# EAGLE design Controller - ESP32 Wroom - Rev. 0.9 (EAGLE 9.6.2)
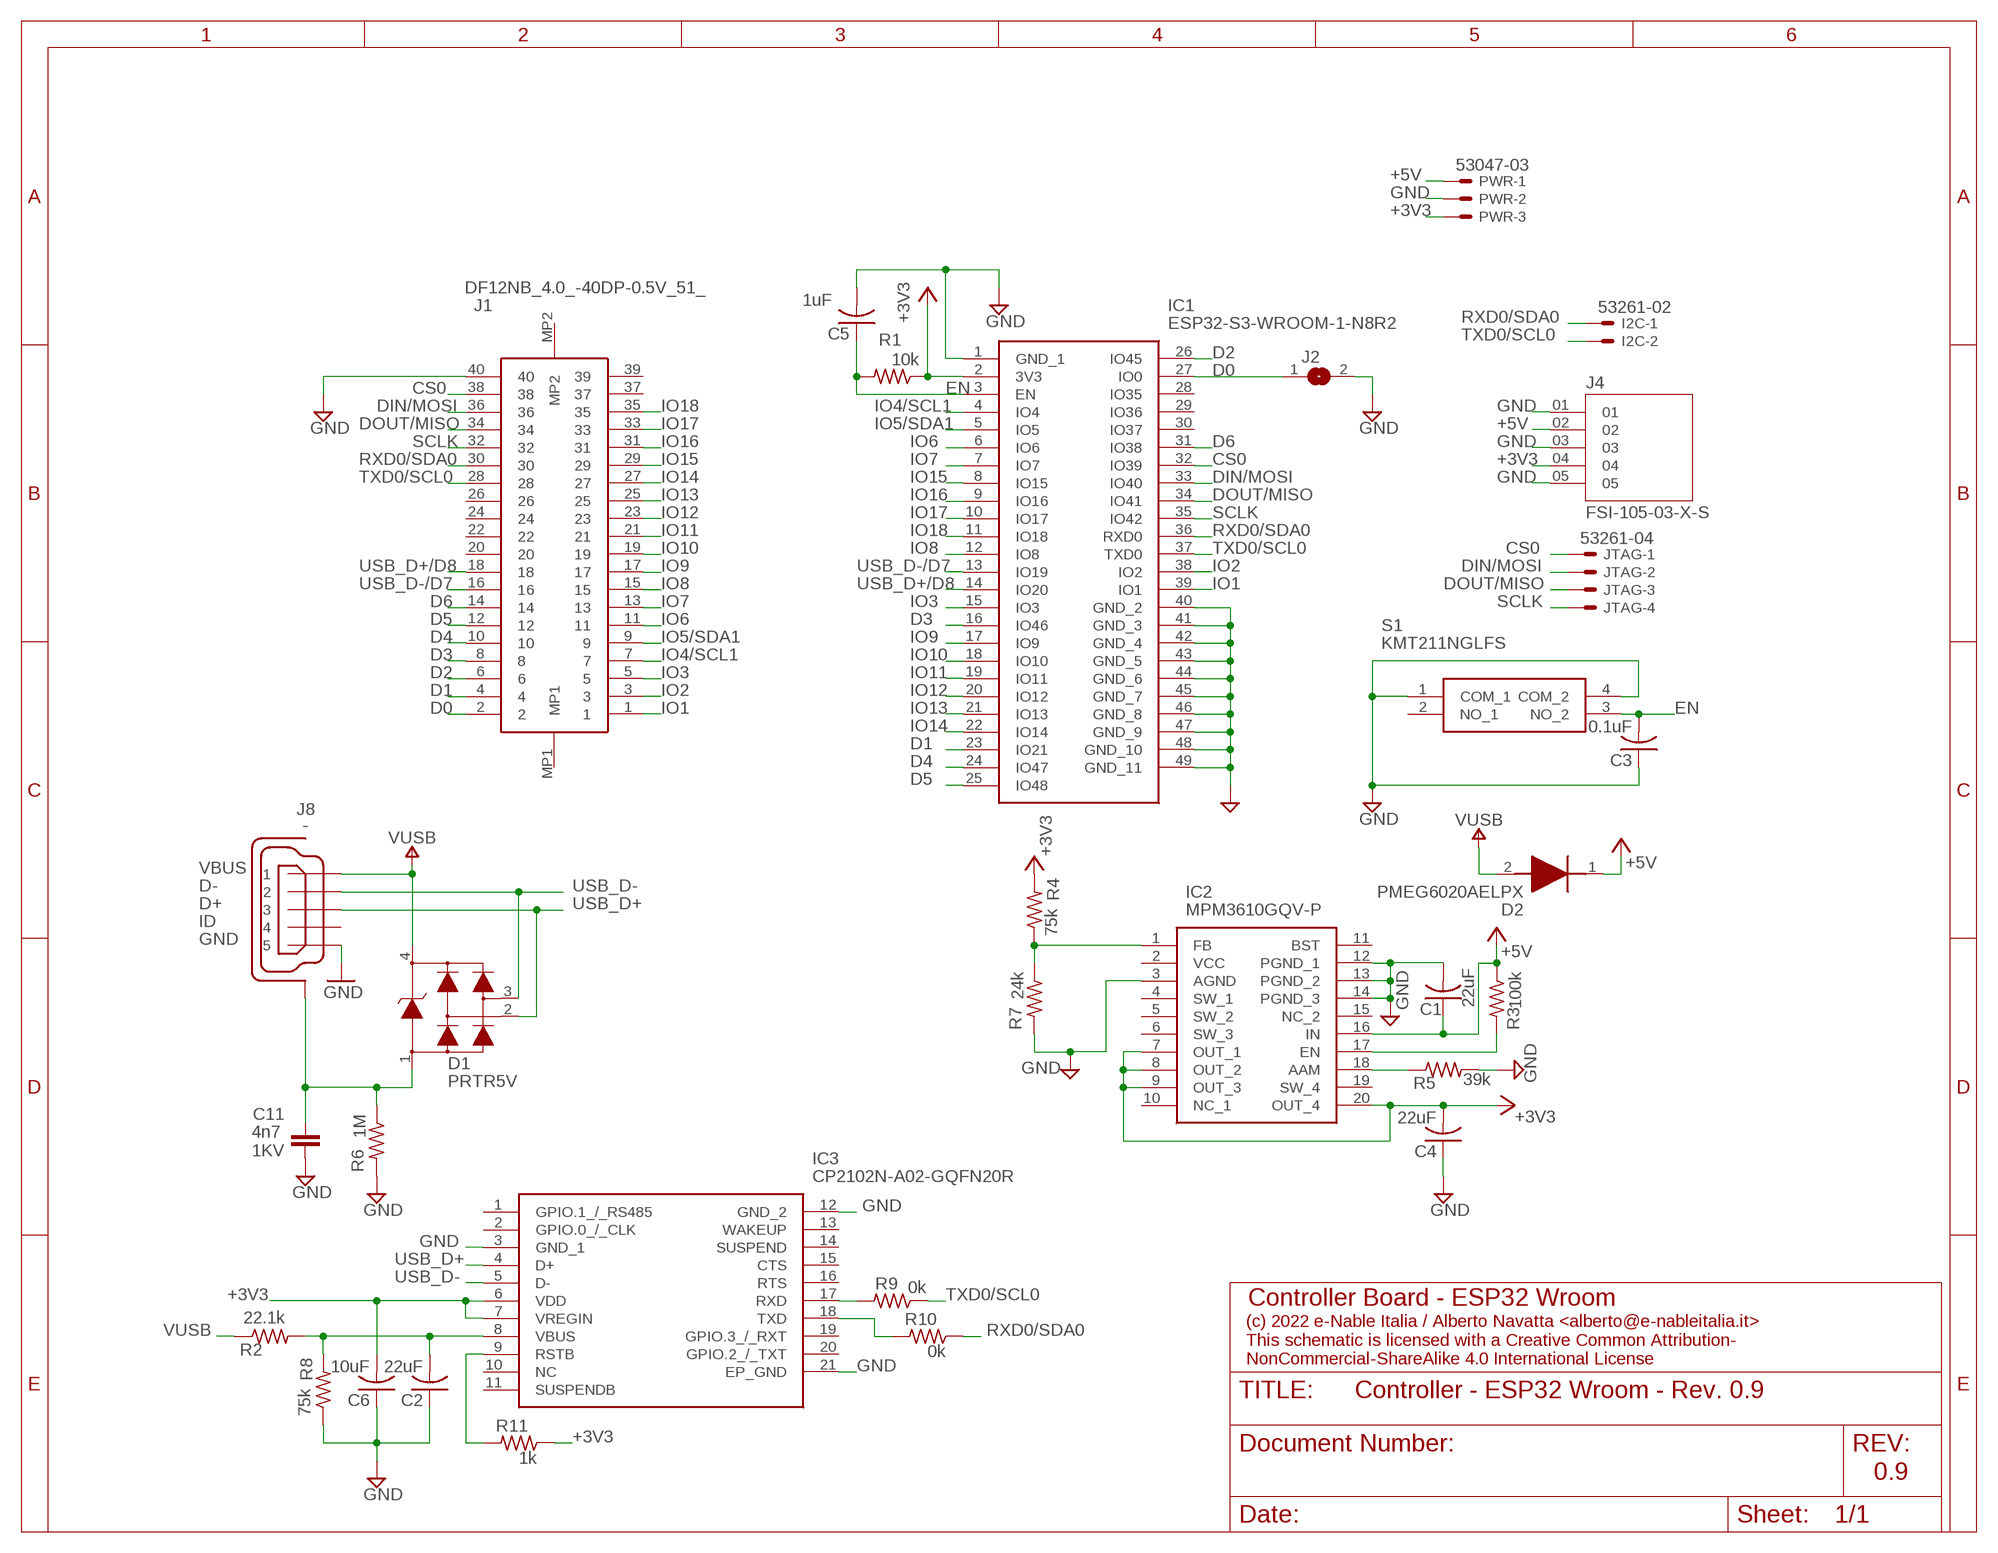
[diagram p0: schematic, sheet 1]

## Parts
C1  22uF  C-USC0603  [C0603]
C2  22uF  C-USC0402  [C0402]
C3  0.1uF  C-USC0402  [C0402]
C4  22uF  C-USC0603  [C0603]
C5  1uF  C-USC0402  [C0402]
C6  10uF  C-USC0402  [C0402]
C11  4n7  C4.7NF-0805  [0805-R2013X50N]
D1  PRTR5V  PRTR5V0U2X,215  [SOT190P230X110-4N]
D2  PMEG6020AELPX  [SODFL4725X110N]
I2C  53261-02  [53261-02]
IC1  ESP32-S3-WROOM-1-N8R2  [ESP32S3WROOM1N8R2]
IC2  MPM3610GQV-P  [MPM3610GQVP]
IC3  CP2102N-A02-GQFN20R  [CP2102NA02GQFN20]
J1  DF12NB_4.0_-40DP-0.5V_51_  [DF12NB4040DP05V51]
J2  SJ  [SJ]
J4  FSI-105-03-X-S  [SAMTEC_FSI-105-03-X-S]
J8  -  USB-MICRO  [ZX62-AB-5PA]
JTAG  53261-04  [53261-04]
PWR  53047-03  [53047-03]
R1  10k  R-US_R0402  [R0402]
R2  22.1k  R-US_R0402  [R0402]
R3  100k  R-US_R0402  [R0402]
R4  75k  R-US_R0402  [R0402]
R5  39k  R-US_R0402  [R0402]
R6  1M  R-US_R0402  [R0402]
R7  24k  R-US_R0402  [R0402]
R8  75k  R-US_R0402  [R0402]
R9  0k  R-US_R0402  [R0402]
R10  0k  R-US_R0402  [R0402]
R11  1k  R-US_R0402  [R0402]
S1  KMT211NGLFS  [KMT211NGLFS]

## Nets
+3V3 [Power]: C4.2 C6.2 IC1.2(3V3) IC2.7(OUT_1) IC2.8(OUT_2) IC2.9(OUT_3) IC2.20(OUT_4) IC3.6(VDD) IC3.7(VREGIN) J4.04 PWR.3 R1.1 R4.2 R11.1
+5V [Power]: C1.1 D2.1(K) IC2.16(IN) J4.02 PWR.1 R3.1
CS0: IC1.32(IO39) J1.38 JTAG.1
D0: IC1.27(IO0) J1.2 J2.1
D1: IC1.23(IO21) J1.4
D2: IC1.26(IO45) J1.6
D3: IC1.16(IO46) J1.8
D4: IC1.24(IO47) J1.10
D5: IC1.25(IO48) J1.12
D6: IC1.31(IO38) J1.14
DIN/MOSI: IC1.33(IO40) J1.36 JTAG.2
DOUT/MISO: IC1.34(IO41) J1.34 JTAG.3
EN: C3.2 C5.1 IC1.3(EN) R1.2 S1.3(NO_2)
GND [GND]: C1.2 C2.1 C3.1 C4.1 C5.2 C6.1 C11.2 IC1.1(GND_1) IC1.40(GND_2) IC1.41(GND_3) IC1.42(GND_4) IC1.43(GND_5) IC1.44(GND_6) IC1.45(GND_7) IC1.46(GND_8) IC1.47(GND_9) IC1.48(GND_10) IC1.49(GND_11) IC2.3(AGND) IC2.12(PGND_1) IC2.13(PGND_2) IC2.14(PGND_3) IC3.3(GND_1) IC3.12(GND_2) IC3.21(EP_GND) J1.40 J2.2 J4.01 J4.03 J4.05 J8.5 PWR.2 R5.2 R6.2 R7.2 R8.1 S1.1(COM_1) S1.4(COM_2)
IO1: IC1.39(IO1) J1.1
IO2: IC1.38(IO2) J1.3
IO3: IC1.15(IO3) J1.5
IO4/SCL1: IC1.4(IO4) J1.7
IO5/SDA1: IC1.5(IO5) J1.9
IO6: IC1.6(IO6) J1.11
IO7: IC1.7(IO7) J1.13
IO8: IC1.12(IO8) J1.15
IO9: IC1.17(IO9) J1.17
IO10: IC1.18(IO10) J1.19
IO11: IC1.19(IO11) J1.21
IO12: IC1.20(IO12) J1.23
IO13: IC1.21(IO13) J1.25
IO14: IC1.22(IO14) J1.27
IO15: IC1.8(IO15) J1.29
IO16: IC1.9(IO16) J1.31
IO17: IC1.10(IO17) J1.33
IO18: IC1.11(IO18) J1.35
N$1: IC2.18(AAM) R5.1
N$2: C2.2 IC3.8(VBUS) R2.2 R8.2
N$3: IC2.1(FB) R4.1 R7.1
N$4: IC2.17(EN) R3.2
N$5: IC3.17(RXD) R9.2
N$6: IC3.18(TXD) R10.2
N$7: C11.1 D1.1 J8.6(SH) J8.7(SH) J8.8(SH) J8.9(SH) J8.10(SH) J8.11(SH) R6.1
N$8: IC3.9(RSTB) R11.2
RXD0/SDA0: I2C.1 IC1.36(RXD0) J1.30 R10.1
SCLK: IC1.35(IO42) J1.32 JTAG.4
TXD0/SCL0: I2C.2 IC1.37(TXD0) J1.28 R9.1
USB_D+: D1.2 IC3.4(D+) J8.3
USB_D+/D8: IC1.14(IO20) J1.18
USB_D-: D1.3 IC3.5(D-) J8.2
USB_D-/D7: IC1.13(IO19) J1.16
VUSB [Power]: D1.4 D2.2(A) J8.1 R2.1
Unconnected: IC1.28(IO35) IC1.29(IO36) IC1.30(IO37) IC2.2(VCC) IC2.4(SW_1) IC2.5(SW_2) IC2.6(SW_3) IC2.10(NC_1) IC2.11(BST) IC2.15(NC_2) IC2.19(SW_4) IC3.1(GPIO.1_/_RS485) IC3.2(GPIO.0_/_CLK) IC3.10(NC) IC3.11(SUSPENDB) IC3.13(WAKEUP) IC3.14(SUSPEND) IC3.15(CTS) IC3.16(RTS) IC3.19(GPIO.3_/_RXT) IC3.20(GPIO.2_/_TXT) J1.20 J1.22 J1.24 J1.26 J1.37 J1.39 J1.MP1 J1.MP2 J8.4 S1.2(NO_1)

## Notes on the sheet
- Controller Board - ESP32 Wroom
- (c) 2022 e-Nable Italia / Alberto Navatta <alberto@e-nableitalia.it>
  This schematic is licensed with a Creative Common Attribution-
  NonCommercial-ShareAlike 4.0 International License
- 0.9

## Library data of the parts
C1-C6 = rcl:C-US: CAPACITOR, American symbol; SPICEPREFIX: C
C11 = Arduino-rcl:C: SMD Capacitor; CODE-ARDUINO: 0689; DATASHEET: http://www.kemet.com/Lists/ProductCatalog/Attachments/40/KEM_C1010_X7R_HV_SMD.pdf; DISTRIBUTOR-LINK: www.kemet.com/docfinder?Partnumber=C0805C472KDRACTU; DISTRIBUTOR-PN: 399-6738-1-ND; MANUFACTURER: Kemet; MANUFACTURER-PN: C0805C472KDRACTU; NOTE: -; VOLTAGE: 1KV
D1 = Arduino-diodes:PRTR5V0U2X,215: USB ESD protection; CODE-ARDUINO: 2209; DATASHEET: http://www.nxp.com/documents/data_sheet/PRTR5V0U2X.pdf; DISTRIBUTOR-LINK: http://www.digikey.com/product-detail/en/nxp-semiconductors/PRTR5V0U2X,215/568-4140-1-ND/1589981; DISTRIBUTOR-PN: 568-4140-1-ND; MANUFACTURER: NXP; MANUFACTURER-PN: PRTR5V0U2X,215
D2 = SamacSys_Parts:PMEG6020AELPX: NEXPERIA - PMEG6020AELPX - Schottky Rectifier, 60 V, 2 A, Single, SOD-128, 2 Pins, 670 mV Source: Datasheet <https://ms.componentsearchengine.com/Datasheets/2/PMEG6020AELPX.pdf>; DESCRIPTION: NEXPERIA - PMEG6020AELPX - Schottky Rectifier, 60 V, 2 A, Single, SOD-128, 2 Pins, 670 mV; HEIGHT: 1.1mm; MANUFACTURER_NAME: Nexperia; MANUFACTURER_PART_NUMBER: PMEG6020AELPX; MOUSER_PART_NUMBER: 771-PMEG6020AELPX; MOUSER_PRICE-STOCK: https://www.mouser.co.uk/ProductDetail/Nexperia/PMEG6020AELPX?qs=bel5lzaZNxQeOe%2FrOz5yeQ%3D%3D
I2C = con-molex:53?-02: CONNECTOR wire to board 1.25 mm (.049 inch) pitch header; MF: MOLEX; OC_FARNELL: 1125373; OC_NEWARK: unknown
IC1 = SamacSys_Parts:ESP32-S3-WROOM-1-N8R2: WiFi Modules - 802.11 (Engineering Samples Only) SMD Module, ESP32-S3R2, 2 MB PSRAM, 8 MB SPI Flash, PCB Antenna ,, Source: Datasheet; DESCRIPTION: WiFi Modules - 802.11 (Engineering Samples Only) SMD Module, ESP32-S3R2, 2 MB PSRAM, 8 MB SPI Flash, PCB Antenna ,,; HEIGHT: 3.25mm; MANUFACTURER_NAME: Espressif Systems; MANUFACTURER_PART_NUMBER: ESP32-S3-WROOM-1-N8R2; MOUSER_PART_NUMBER: 356-ESP32-S3WRM1N8R2; MOUSER_PRICE-STOCK: https://www.mouser.co.uk/ProductDetail/Espressif-Systems/ESP32-S3-WROOM-1-N8R2?qs=Wj%2FVkw3K%252BMCC1Ha9x85iJA%3D%3D
IC2 = SamacSys_Parts:MPM3610GQV-P: Switching Voltage Regulators 24V/1A DC/DC Mini- Module Reg w Inductr Source: Datasheet <https://componentsearchengine.com/Datasheets/1/MPM3610GQV-P.pdf>; DESCRIPTION: Switching Voltage Regulators 24V/1A DC/DC Mini- Module Reg w Inductr; HEIGHT: 1.65mm; MANUFACTURER_NAME: Monolithic Power Systems (MPS); MANUFACTURER_PART_NUMBER: MPM3610GQV-P; MOUSER_PART_NUMBER: 946-MPM3610GQV-P; MOUSER_PRICE-STOCK: https://www.mouser.co.uk/ProductDetail/Monolithic-Power-Systems-MPS/MPM3610GQV-P?qs=uA8e7uFv8Fj%2FtQLBFM6HcA%3D%3D
IC3 = SamacSys_Parts:CP2102N-A02-GQFN20R: Full Speed USB to UART Bridge USB 2.0 3.3V T/R Automotive 20-Pin QFN EP Source: Datasheet <https://www.silabs.com/documents/public/data-sheets/cp2102n-datasheet.pdf>; DESCRIPTION: Full Speed USB to UART Bridge USB 2.0 3.3V T/R Automotive 20-Pin QFN EP; HEIGHT: 0.8mm; MANUFACTURER_NAME: Silicon Labs; MANUFACTURER_PART_NUMBER: CP2102N-A02-GQFN20R; MOUSER_PART_NUMBER: 634-CP2102NA02QFN20R; MOUSER_PRICE-STOCK: https://www.mouser.co.uk/ProductDetail/Silicon-Labs/CP2102N-A02-GQFN20R?qs=u16ybLDytRbf2uwPkMBdUg%3D%3D
J1 = SamacSys_Parts:DF12NB_4.0_-40DP-0.5V_51_: Board to!! Board !! & Mezzanine Connectors CONN HDR 40POS SMD G Source: Datasheet <https://www.hirose.com/en/product/document?clcode=CL0537-0596-0-51&productname=DF12NB(4.0)-40DP-0.5V(51)&series=DF12N&documenttype=2DDrawing&lang=en&documentid=0001367371>; DESCRIPTION: Board to!! Board !! & Mezzanine Connectors CONN HDR 40POS SMD G; HEIGHT: 3.5mm; MANUFACTURER_NAME: Hirose; MANUFACTURER_PART_NUMBER: DF12NB(4.0)-40DP-0.5V(51); MOUSER_PART_NUMBER: 798-DF12NB4040DP0551; MOUSER_PRICE-STOCK: https://www.mouser.co.uk/ProductDetail/Hirose-Connector/DF12NB4.0-40DP-0.5V51?qs=DPoM0jnrROUKZpllIjGjYw%3D%3D
J2 = jumper:SJ: SMD solder JUMPER
J4 = FSI-105-03-X-S:FSI-105-03-X-S: 1mm SINGLE ELEMENT INTERFACE Check availability <https://pricing.snapeda.com/parts/FSI-105-03-G-S/Samtec/view-part?ref=eda>; AVAILABILITY: In Stock; DESCRIPTION: 5 Position Connector Stacking Compression Surface Mount Gold; MF: Samtec; MP: FSI-105-03-G-S; PACKAGE: None; PRICE: None; PURCHASE-URL: https://pricing.snapeda.com/search/part/FSI-105-03-G-S/?ref=eda
J8 = Arduino-connectors:USB-MICRO: USB - micro AB USB 2.0 Receptacle Connector 5 Position Surface Mount, Right Angle, Horizontal; CODE-ARDUINO: 2219; DATASHEET: https://www.hirose.com/product/en/download_file/key_name/ZX/category/Catalog/doc_file_id/31704/?file_category_id=4&item_id=13&is_series=1; DISTRIBUTOR-LINK: http://www.digikey.com/product-detail/en/hirose-electric-co-ltd/ZX62-AB-5PA(31)/H125279CT-ND/5994741; DISTRIBUTOR-PN: H125279CT-ND; MANUFACTURER: Hirose; MANUFACTURER-PN: ZX62-AB-5PA(31)
JTAG = con-molex:53?-04: CONNECTOR wire to board 1.25 mm (.049 inch) pitch header; MF: MOLEX; OC_FARNELL: 1125374; OC_NEWARK: unknown
PWR = con-molex:53?-03: CONNECTOR wire to board 1.25 mm (.049 inch) pitch header; MF: MOLEX; MPN: 530470310; OC_FARNELL: 9732853; OC_NEWARK: 14R5412
R1-R11 = rcl:R-US_: RESISTOR, American symbol; SPICEPREFIX: R
S1 = SamacSys_Parts:KMT211NGLFS: Tactile Switches SPST N.O. GULLWING FOR SMT Source: Datasheet <https://www.ckswitches.com/media/1455/kmt2.pdf>; DESCRIPTION: Tactile Switches SPST N.O. GULLWING FOR SMT; HEIGHT: 0.8mm; MANUFACTURER_NAME: C & K COMPONENTS; MANUFACTURER_PART_NUMBER: KMT211NGLFS; MOUSER_PART_NUMBER: 611-KMT211NGLFS; MOUSER_PRICE-STOCK: https://www.mouser.co.uk/ProductDetail/CK/KMT211NGLFS?qs=hvk6vzacGVhmRxqfjOQwQg%3D%3D

## Net classes
2 Power: width 0.203 mm

## Board
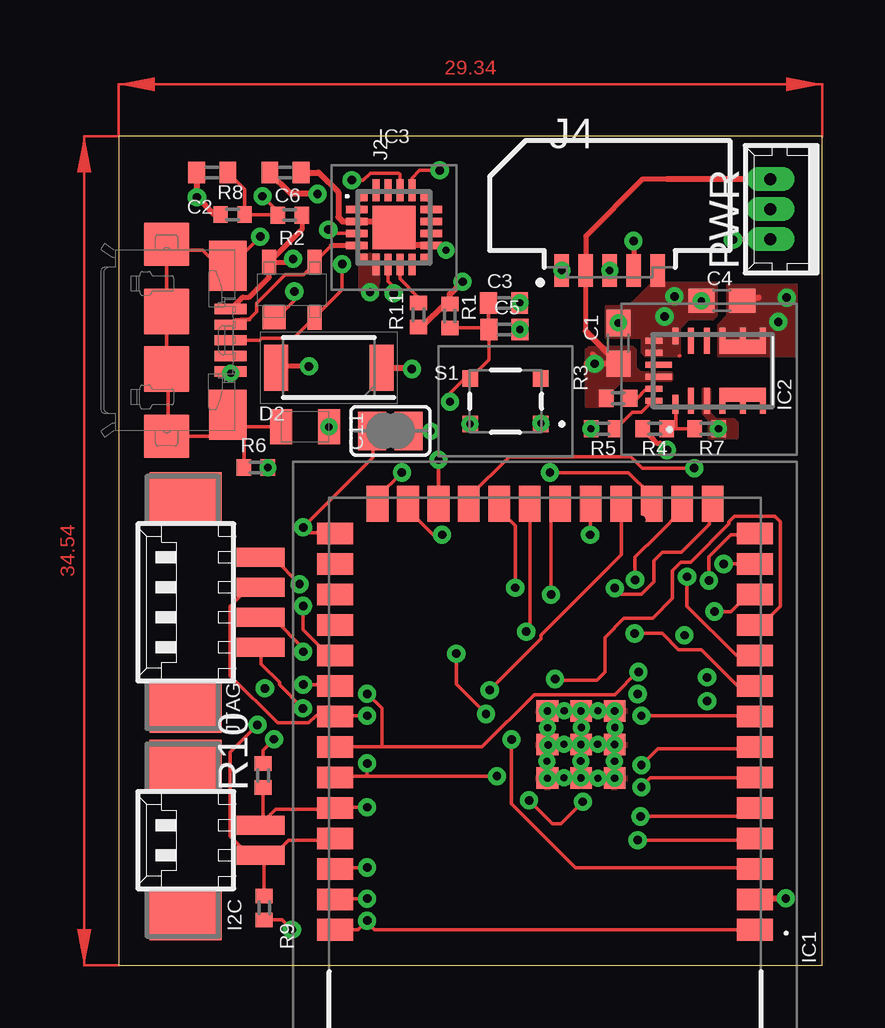
[diagram p1: board, top side]
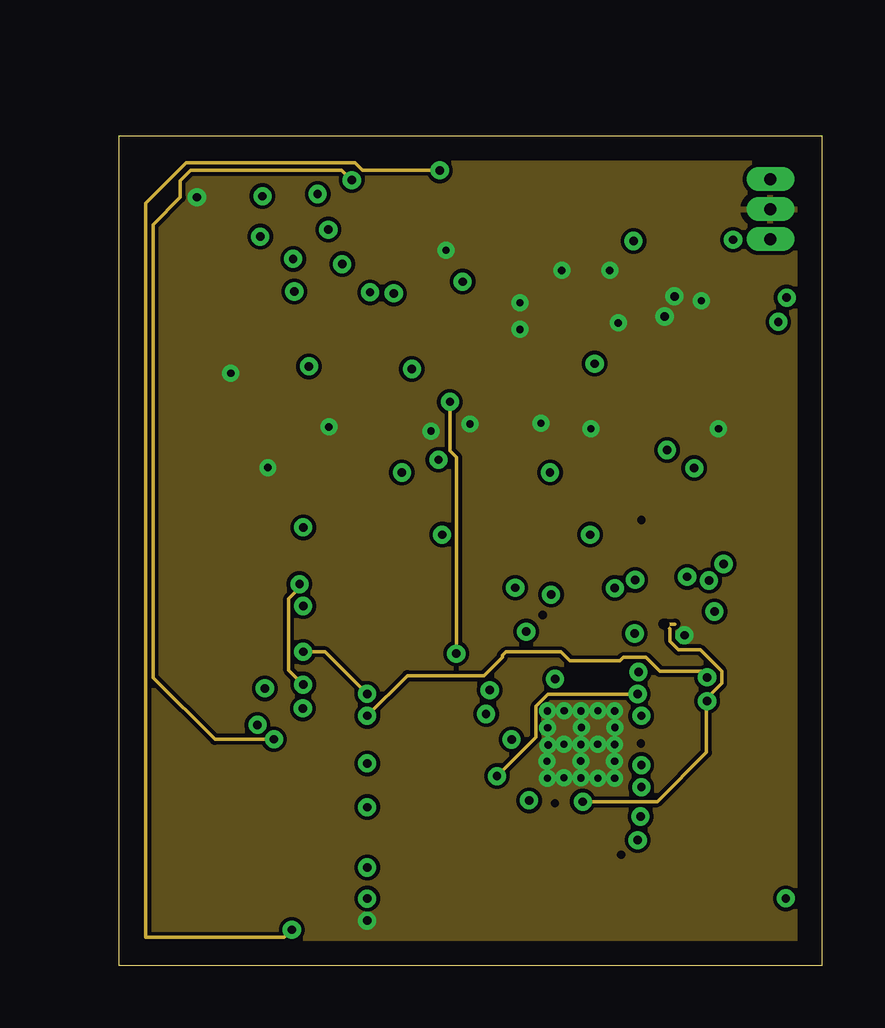
[diagram p2: board, inner layer Route2]
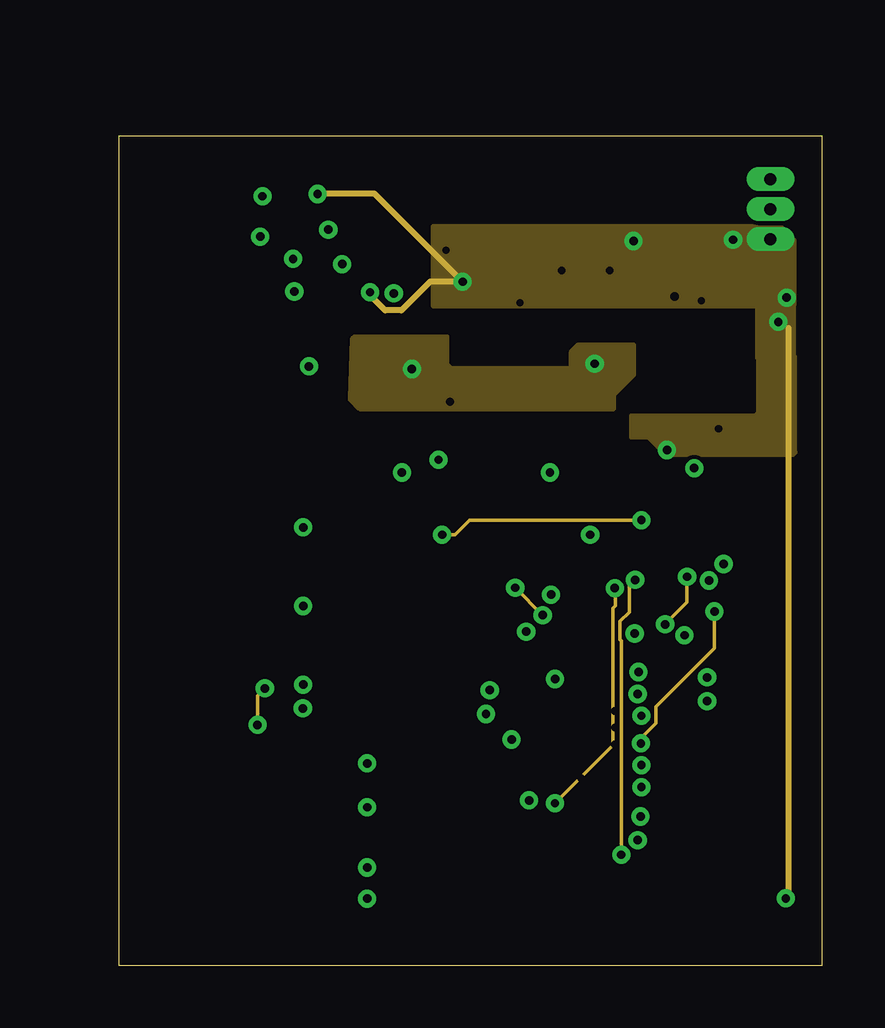
[diagram p3: board, inner layer Route15]
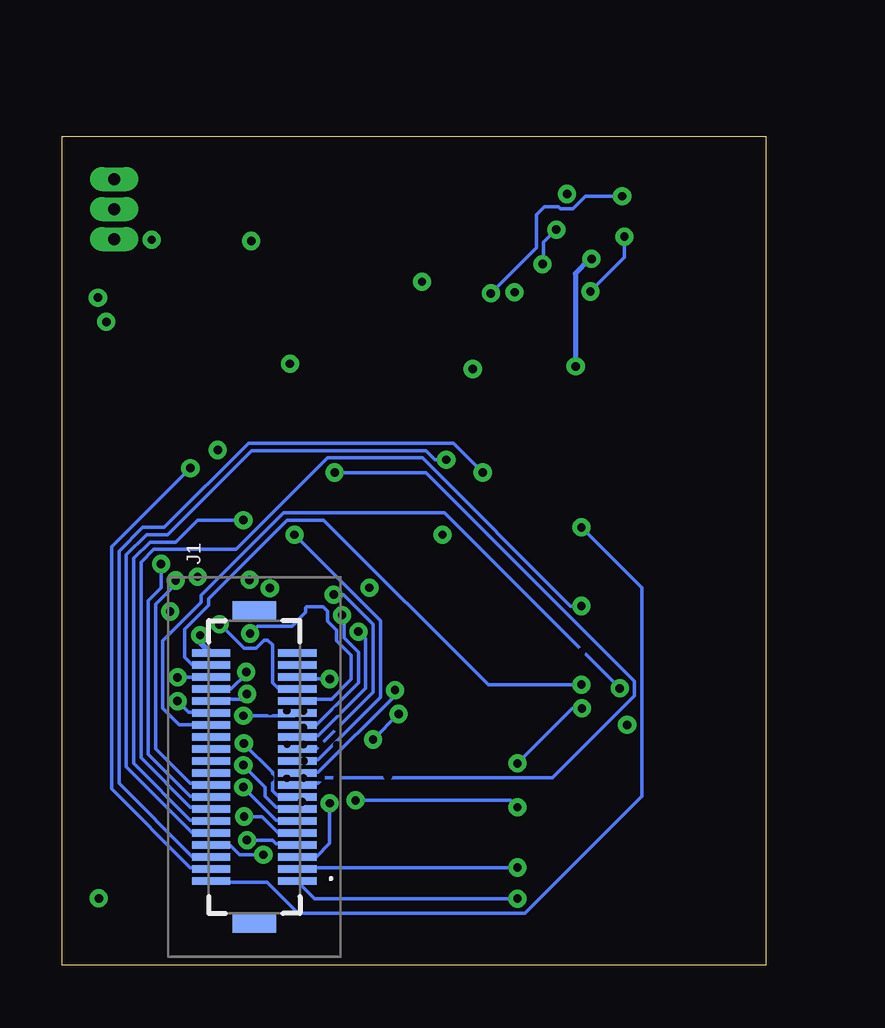
[diagram p4: board, bottom side, seen from below]

Size 29.34 x 34.54 mm. Coordinates in mm from the lower left corner, seen from the top.
Outline: 0,0 29.34,0 29.34,34.54 0,34.54 0,0
Copper layers ([2:1+(2*15)+16:15]): Top 0.035mm / dielectric 0.11mm / Route2 0.035mm / dielectric 1.6mm / Route15 0.035mm / dielectric 0.11mm / Bottom 0.035mm
Design rules "default *": minimum track width 6mil, minimum drill 0.35mm, track to track 6mil, track to pad 6mil, pad to pad 6mil, via to via 6mil, smd to smd 6mil, copper to edge 40mil, drill to drill 6mil, minimum pad ring 10mil, minimum via ring 8mil, stop-mask expansion 4mil, vias tented up to drill 0mil, thermal gap 10mil

### Footprints (pad centres in the part's own frame; a part is rotated, then mirrored left to right if it is on the bottom)
C0603 = smd 1.1 x 1: 1 -0.85,0; 2 0.85,0
C0402 = smd 0.7 x 0.9: 1 -0.65,0; 2 0.65,0
0805-R2013X50N = smd 0.95 x 1.45: 1 -1,0; 2 1,0
SOT190P230X110-4N = smd 1 x 1: 1 -1.15,0.75 | smd 1 x 0.6: 2 -1.15,-0.95; 3 1.15,-0.95; 4 1.15,0.95
SODFL4725X110N = smd 1 x 1.93: 1 -2.2,0; 2 2.2,0
53261-02 = smd 0.8 x 2: 1 0.625,-2.5; 2 -0.625,-2.5 | smd 2.1 x 3: S1 3.125,0.625; S2 -3.125,0.625
ESP32S3WROOM1N8R2 = smd 1.5 x 0.9: 1 -8.75,5.26; 2 -8.75,3.99; 3 -8.75,2.72; 4 -8.75,1.45; 5 -8.75,0.18; 6 -8.75,-1.09; 7 -8.75,-2.36; 8 -8.75,-3.63; 9 -8.75,-4.9; 10 -8.75,-6.17; 11 -8.75,-7.44; 12 -8.75,-8.71; 13 -8.75,-9.98; 14 -8.75,-11.25; 27 8.75,-11.25; 28 8.75,-9.98; 29 8.75,-8.71; 30 8.75,-7.44; 31 8.75,-6.17; 32 8.75,-4.9; 33 8.75,-3.63; 34 8.75,-2.36; 35 8.75,-1.09; 36 8.75,0.18; 37 8.75,1.45; 38 8.75,2.72; 39 8.75,3.99; 40 8.75,5.26 | smd 0.9 x 1.5: 15 -6.985,-12.5; 16 -5.715,-12.5; 17 -4.445,-12.5; 18 -3.175,-12.5; 19 -1.905,-12.5; 20 -0.635,-12.5; 21 0.635,-12.5; 22 1.905,-12.5; 23 3.175,-12.5; 24 4.445,-12.5; 25 5.715,-12.5; 26 6.985,-12.5 | smd 0.9 x 0.9: 41 -1.5,-2.46; 42 -1.5,-1.06; 43 -2.9,-1.06; 44 -2.9,-2.46; 45 -2.9,-3.86; 46 -1.5,-3.86; 47 -0.1,-3.86; 48 -0.1,-2.46; 49 -0.1,-1.06
MPM3610GQVP = smd 0.8 x 0.25: 1 -1.4,1.55 | smd 1.1 x 0.25: 2 -1.25,0.9; 3 -1.25,0.25; 10 1.25,0.25; 11 1.25,0.9 | smd 0.5 x 0.25: 4 -1.55,-0.4; 5 -1.55,-1.25; 6 -1.55,-2.1; 7 1.55,-2.1; 8 1.55,-1.25; 9 1.55,-0.4 | smd 0.7 x 0.25: 12 1.45,1.55 | smd 0.25 x 0.7: 13 1.25,2.45; 14 0.75,2.45; 17 -0.75,2.45; 18 -1.25,2.45 | smd 0.25 x 1.1: 15 0.25,2.25; 16 -0.25,2.25 | smd 0.6 x 1.95: 19 -1,-1.25; 20 1,-1.25
CP2102NA02GQFN20 = smd 0.3 x 0.3: 1 -1.25,1.25; 6 -1.25,-1.25; 11 1.25,-1.25; 16 1.25,1.25 | smd 0.9 x 0.3: 2 -1.55,0.75; 3 -1.55,0.25; 4 -1.55,-0.25; 5 -1.55,-0.75; 12 1.55,-0.75; 13 1.55,-0.25; 14 1.55,0.25; 15 1.55,0.75 | smd 0.3 x 0.9: 7 -0.75,-1.55; 8 -0.25,-1.55; 9 0.25,-1.55; 10 0.75,-1.55; 17 0.75,1.55; 18 0.25,1.55; 19 -0.25,1.55; 20 -0.75,1.55 | smd 1.8 x 1.8: 21 0,0
DF12NB4040DP05V51 = smd 0.3 x 1.6: 1 -4.75,-1.8; 2 -4.75,1.8; 3 -4.25,-1.8; 4 -4.25,1.8; 5 -3.75,-1.8; 6 -3.75,1.8; 7 -3.25,-1.8; 8 -3.25,1.8; 9 -2.75,-1.8; 10 -2.75,1.8; 11 -2.25,-1.8; 12 -2.25,1.8; 13 -1.75,-1.8; 14 -1.75,1.8; 15 -1.25,-1.8; 16 -1.25,1.8; 17 -0.75,-1.8; 18 -0.75,1.8; 19 -0.25,-1.8; 20 -0.25,1.8; 21 0.25,-1.8; 22 0.25,1.8; 23 0.75,-1.8; 24 0.75,1.8; 25 1.25,-1.8; 26 1.25,1.8; 27 1.75,-1.8; 28 1.75,1.8; 29 2.25,-1.8; 30 2.25,1.8; 31 2.75,-1.8; 32 2.75,1.8; 33 3.25,-1.8; 34 3.25,1.8; 35 3.75,-1.8; 36 3.75,1.8; 37 4.25,-1.8; 38 4.25,1.8; 39 4.75,-1.8; 40 4.75,1.8 | smd 0.8 x 1.8: MP1 -6.5,0; MP2 6.5,0
SJ = smd 1.168 x 1.6: 1 -0.762,0; 2 0.762,0
SAMTEC_FSI-105-03-X-S = smd 0.6 x 1.35: 01 -2,0; 02 -1,0; 03 0,0; 04 1,0; 05 2,0
ZX62-AB-5PA = smd 0.4 x 1.35: 1 -1.3,3.025; 2 -0.65,3.025; 3 0,3.025; 4 0.65,3.025; 5 1.3,3.025 | smd 2.1 x 1.6: 6 3.1,2.9; 11 -3.1,2.9 | smd 1.8 x 1.9: 7 4,0.35; 10 -4,0.35 | smd 1.9 x 1.9: 8 1.2,0.35; 9 -1.2,0.35
53261-04 = smd 0.8 x 2: 1 1.875,-2.5; 2 0.625,-2.5; 3 -0.625,-2.5; 4 -1.875,-2.5 | smd 2.1 x 3: S1 4.375,0.625; S2 -4.375,0.625
53047-03 = drill 0.5 pad 0.698 long: 1 1.25,0.45; 2 0,0.45; 3 -1.25,0.45
R0402 = smd 0.6 x 0.7: 1 -0.5,0; 2 0.5,0
KMT211NGLFS = smd 0.65 x 0.7: 1 -1.475,0.95; 2 -1.475,-0.95; 3 1.475,-0.95; 4 1.475,0.95

### Placement (x,y rotation side)
C1  20.83,25.91 90 top
C2  3.9,33.03 0 top
C3  16.07,27.59 180 top
C4  25.15,27.69 0 top
C5  16.09,26.49 0 top
C6  6.95,33.02 180 top
C11  7.77,22.42 0 top
D1  7.23,28.14 90 top
D2  8.76,24.89 180 top
I2C  3.43,5.21 90 top
IC1  17.78,6.73 180 top
IC2  24.77,24.77 90 top
IC3  11.48,30.74 0 top
J1  21.34,8.25 90 bottom
J2  11.33,22.26 0 top
J4  20.47,28.94 0 top
J8  1.65,26.04 270 top
JTAG  3.43,15.11 90 top
PWR  27.62,31.5 90 top
R1  13.81,27.05 270 top
R2  7.13,31.25 180 top
R3  20.83,23.62 0 top
R4  22.35,22.35 180 top
R5  20.19,22.35 180 top
R6  5.72,20.73 0 top
R7  24.51,22.35 0 top
R8  4.75,31.27 0 top
R9  6.07,2.39 270 top
R10  6.03,7.9 90 top
R11  12.5,27.1 90 top
S1  16.13,23.5 180 top

### Tracks (layer width: path | path; a pad name or v marks a point on that pad's centre or on a via)
+3V3  (via drill 0.35, 0.35 pad 0.18)
  Top 0.203: 26.52,2.77 IC1.2 | 13.76,27.6 R1.1 | v22.86,21.46 22.57,21.75 22.45,21.75 22.3,21.9 22.3,21.91 R4.2 | v21.46,30.17 21.47,30.16 J4.04 | PWR.3 25.64,30.25 v25.62,30.22
  Top 0.254: IC1.2 26.57,2.78 v27.82,2.78 | R1.1 13.81,27.96 14.33,28.47 v14.34,28.47 | v8.3,32.13 7.19,32.13 C6.2 | R11.1 12.64,26.6 13.64,27.6 13.76,27.6 | C4.2 26.12,27.81 26.67,27.81
  Route15 0.254: v27.82,2.78 27.94,2.9 27.94,26.54 | 10.68,32.14 v14.34,28.47 12.99,28.47 11.79,27.28 11.11,27.28 10.48,27.9 v10.48,28.03 | 10.68,32.14 10.66,32.15 | 10.68,32.14 v8.3,32.14 v8.3,32.13
  other vias: 27.85,27.81 27.5,26.8
  pour Top (no thermals): 25.4,28.32 25.4,27.05 25.02,26.67 25.02,25.4 28.32,25.4 28.32,28.32
  pour Route15 (no thermals): 13.12,30.78 27.57,30.78 28.16,30.2 28.16,27.52 28.09,27.45 13.12,27.45
  pour Route15 (no thermals): 26.67,27.81 28.1,27.81 28.1,25.27 26.67,25.27
  pour Top (no thermals): 10.06,29.64 10.83,29.64 10.83,28.43 10.8,28.4 10.8,27.9 10.73,27.83 10.33,27.83 10.06,28.1
  pour Route15 (no thermals): 26.65,25.27 26.65,23.04 26.59,22.98 26.52,22.9 21.35,22.9 21.35,21.97 22.07,21.97 22.79,21.25 28.13,21.25 28.25,21.37 28.22,21.4 28.22,25.36
+5V  (via drill 0.35)
  Top 0.203: 19.77,25.45 20.17,25.06 20.32,25.06 C1.1 v19.85,25.06 | 10.9,24.26 10.9,24.87 D2.1 | 19.47,26.41 J4.02 19.47,30.38 21.84,32.74 22.88,32.74
  Top 0.254: D2.1 12.17,24.89 v12.23,24.84 | C1.1 19.73,26.15 19.47,26.41 | 20.32,25.06 v19.85,25.06 19.52,25.06 | PWR.1 22.88,32.74
  pour Top (no thermals): 20.16,25.74 21.42,25.74 21.52,25.64 21.52,24.91 21.75,24.68 23.03,24.68 23.05,24.66 23.05,24.39 23.03,24.36 20.99,24.36 20.63,24.01 20.59,23.96 20.59,23.29 19.51,23.29 19.51,25.64 19.6,25.73 20.12,25.73
  pour Route15 (no thermals): 9.76,26.11 9.84,26.19 13.67,26.19 13.67,25.04 13.85,24.86 18.78,24.86 18.79,24.85 18.89,24.94 18.89,25.57 19.16,25.84 21.47,25.84 21.47,24.6 21.17,24.3 20.63,23.76 20.63,23.16 10.07,23.16 9.66,23.57
CS0  (via drill 0.35, 0.35 layers 1-2)
  Top 0.152: v7.7,11.68 8.99,11.68 IC1.32 | v7.54,15.87 6.48,16.94 5.94,16.94 JTAG.1
  Route2 0.152: v7.54,15.87 7.54,15.72 7.09,15.26 7.09,12.29 v7.7,11.68
  Bottom 0.152: v7.7,11.68 11.58,11.68 18.44,18.54 19.96,18.54 23.24,15.26 23.24,14.99 24.23,14 24.23,12.83 23.93,12.52 23.16,12.52 J1.38
D0  (via drill 0.35)
  Top 0.152: IC1.27 8.99,18.01 7.92,18.01 v7.7,18.24 10.61,21.15 10.61,22.22 J2.1
  Bottom 0.152: v7.7,18.24 5.18,15.72 5.18,7.04 10.06,2.16 19.51,2.16 20.8,3.45 23.09,3.45 J1.2
D1  (via drill 0.35)
  Top 0.152: v24,20.71 21.83,20.71 21.35,21.19 16.29,21.19 14.63,19.53 14.63,19.3 IC1.23
  Bottom 0.152: v24,20.71 27.28,17.43 27.28,7.34 24,4.06 23.16,4.06 J1.4
D2  (via drill 0.35)
  Top 0.152: v11.81,20.52 10.82,19.53 10.82,19.3 IC1.26
  Bottom 0.152: v11.81,20.52 13.03,21.74 21.58,21.74 25.09,18.24 25.98,18.24 26.98,17.25 26.98,7.57 23.93,4.52 23.16,4.52 J1.6
D3  (via drill 0.35, 0.35 layers 15-16)
  Top 0.152: v21.53,16.05 21.53,16.99 22.53,17.98 23.47,18.92 23.47,19.23 IC1.16
  Route15 0.152: v21.53,16.05 21.3,15.81 21.3,14.71 20.91,14.32 20.91,13.57 20.95,13.52 20.95,8.76 v20.95,4.6
  Bottom 0.152: v20.95,4.6 21.95,4.6 22.33,4.98 23.09,4.98 J1.8
D4  (via drill 0.35)
  Top 0.152: v13.34,21.06 IC1.24
  Bottom 0.152: v13.34,21.06 13.79,21.06 14.17,21.44 21.45,21.44 24.95,17.93 25.83,17.93 26.67,17.09 26.67,8.25 23.93,5.51 23.16,5.51 J1.10
D5  (via drill 0.35, 0.35 layers 15-16)
  Top 0.152: v13.49,17.93 13.11,17.93 12.12,18.92 12.12,19.23 IC1.25
  Route15 0.152: v13.49,17.93 14.02,17.93 14.63,18.54 v21.79,18.54
  Bottom 0.152: v21.79,18.54 23.7,18.54 24.61,17.63 25.68,17.63 26.36,16.94 26.36,8.41 24,6.04 23.16,6.04 J1.12
D6  (via drill 0.35)
  Top 0.152: v7.7,14.96 7.7,13.97 8.76,12.9 8.99,12.9 IC1.31
  Bottom 0.152: v7.7,14.96 8.15,14.96 14.33,21.13 18.29,21.13 22.1,17.32 25.53,17.32 26.06,16.79 26.06,8.64 24,6.58 23.16,6.58 J1.14
DIN/MOSI  (via drill 0.35, 0.35 layers 1-2)
  Top 0.152: 8.99,10.39 IC1.33 9.07,10.39 | JTAG.2 5.87,15.72 5.41,15.72 4.65,14.96 4.65,12.06 6.62,10.09 7.93,10.09 8.23,10.39 9.07,10.39 | 9.07,10.39 9.17,10.39 v10.36,10.39
  Route2 0.152: v10.36,10.39 12.04,12.06 15.24,12.06 16,12.83 16,12.9 16.15,13.06 18.44,13.06 18.82,12.67 20.9,12.67 21.05,12.82 21.98,12.82 22.56,12.24 24.29,12.24 v24.54,11.99
  Bottom 0.152: J1.36 23.16,11.99 v24.54,11.99
DOUT/MISO  (via drill 0.35, 0.35 layers 1-2)
  Top 0.152: 10.97,9.09 9.07,9.09 IC1.34 | v7.7,13.06 7.7,13.21 6.48,14.43 5.94,14.43 JTAG.3 | v10.36,11.3 10.97,10.69 10.97,9.09 | 10.97,9.09 15.16,9.09 17.34,11.27 20.69,11.27 21.64,12.21 v21.67,12.21
  Route2 0.152: v7.7,13.06 8.61,13.06 v10.36,11.3
  Bottom 0.152: 22.33,11.53 23.09,11.53 J1.34 22.3,11.5 21.67,12.13 v21.67,12.21
EN  (via drill 0.35, 0.35 layers 1-2)
  Top 0.152: v16.38,9.4 16.38,6.73 19.05,4.06 26.52,4.06 IC1.3 | C3.2 15.43,26.5 C5.1 | C5.1 15.38,26.55 R1.2 | C5.1 15.44,25.23 S1.3 14.63,24.41 14.4,24.41 13.81,23.82 v13.81,23.47 | v14.08,12.98 14.08,11.7 v15.32,10.46
  Route2 0.152: v13.81,23.47 13.81,21.44 14.09,21.16 14.09,17.68 14.08,17.67 v14.08,12.98
  Bottom 0.152: v15.32,10.46 v16.38,9.4
GND  (via drill 0.3 layers 1-2, 0.3 pad 0.18 layers 1-2, 0.35, 0.35 layers 1-2, 0.35 pad 0.18 layers 1-2)
  Top 0.152: 17.91,7.8 IC1.49 17.98,7.8 | 20.65,7.8 IC1.43 20.73,7.72 | 19.36,7.8 IC1.42 | 20.73,9.25 IC1.44 20.65,9.25 | 20.73,10.54 IC1.45 | 19.28,9.25 IC1.41 19.36,9.25 | 19.28,10.54 IC1.46 19.2,10.54 | 17.91,9.25 IC1.48 | 17.91,10.46 IC1.47 v18.57,10.59 v18.58,10.6 | v17.6,22.58 S1.1 17.68,22.5 17.83,22.35 | 4.65,24.79 J8.5 v4.68,24.65 | IC1.40 9.07,1.47 9.98,1.47 v10.36,1.85 10.36,1.78 10.67,1.47 26.52,1.47 IC1.1 | 23.39,25.4 23.37,25.4 | IC3.12 13.46,29.99 v13.65,29.79 | v16.73,27.59 | J2.2 v13.01,22.26 v13.02,22.25
  Top 0.203: v17.6,22.59 v17.6,22.58 | v17.6,22.58 17.68,22.5 | S1.1 v17.6,22.58
  Top 0.254: v16.73,27.59 16.74,27.57 | C6.1 8.34,33.02 9.16,32.2 9.16,31.16 9.33,30.99 IC3.3 11.23,30.99 IC3.21 11.43,30.69 11.43,30.35 11.8,29.99 IC3.12 | C2.1 v3.25,32 v3.26,31.99 3.99,31.27 R8.1 | IC1.42 | IC1.48 v17.91,9.17
  Bottom 0.254: J1.40 23.59,13.46 v23.59,13.74
  other vias: 23.17,27.86 22.76,27.02 17.88,10.59 19.28,10.59 20.68,10.59 20.68,9.19 20.68,7.79 19.28,7.8 17.88,7.79 19.28,9.19 16.74,26.49 20.83,26.76 24.3,27.69 27.17,31.5 19.98,10.6 20.69,9.9 19.29,9.9 17.89,9.89 19.97,9.2 18.57,9.2 20.68,8.5 19.27,8.5 17.86,8.49 18.57,7.81 19.98,7.79 20.47,28.94 18.47,28.94 8.77,22.42 8.77,22.42 19.69,22.35 6.22,20.73 14.65,22.55 25.01,22.35
  pour Top (no thermals): 20.33,27.43 21.27,27.43 22.24,28.41 24.89,28.41 24.89,27.05 24.77,26.92 23.75,26.92 23.37,26.54 23.37,25.4 21.97,25.4 21.84,25.53 21.84,26.16 20.33,26.16
  pour Top (no thermals): 24.38,24 24.38,22.99 24.64,22.73 24.64,21.97 25.78,21.97 25.78,22.61 25.65,22.73 24.89,22.73 24.64,22.99 24.64,24
  pour Route2: 0.57,0.4 28.4,0.4 28.78,0.78 28.78,33.76 28.55,33.99 0.46,33.91
  pour Top: 17.45,11.04 21.12,11.04 21.15,11 21.15,7.36 17.5,7.33 17.44,7.39 17.44,10.55 17.49,10.6
  pour Top: 17.45,11.02 21.08,11.02 21.16,10.94 21.16,7.36 17.55,7.36 17.45,7.36 17.44,7.37
IO1  (via drill 0.35)
  Top 0.152: v10.36,2.77 9.07,2.77 IC1.39
  Bottom 0.152: v10.36,2.77 18.82,2.77 19.51,3.45 J1.1
IO2  (via drill 0.35)
  Top 0.152: v10.36,4.06 9.07,4.06 IC1.38
  Bottom 0.152: v10.36,4.06 19.51,4.06 J1.3
IO3  (via drill 0.35, 0.35 layers 15-16)
  Top 0.152: 24.77,18.92 IC1.15 24.62,19.09 24.62,18.37 23.47,17.21 22.67,17.21 22.32,16.86 22.32,15.97 21.79,15.44 20.95,15.44 v20.69,15.71
  Route15 0.152: v20.69,15.71 20.71,15.68 20.71,14.98 20.6,14.86 20.6,9.15 v18.19,6.75
  Bottom 0.152: v18.19,6.75 18.19,5.08 18.75,4.52 19.51,4.52 J1.5
IO4/SCL1  (via drill 0.35)
  Top 0.152: v21.64,5.21 26.52,5.21 IC1.4
  Bottom 0.152: v21.64,5.21 20.57,5.21 20.42,5.06 19.58,5.06 J1.7
IO5/SDA1  (via drill 0.35)
  Top 0.152: v21.76,6.19 26.44,6.19 IC1.5
  Bottom 0.152: v21.76,6.19 21.74,6.18 21.01,6.18 20.34,5.51 19.58,5.51 J1.9
IO6  (via drill 0.35)
  Top 0.152: v21.79,7.42 22.17,7.8 26.52,7.8 IC1.6
  Bottom 0.152: v21.79,7.42 20.42,6.04 19.58,6.04 J1.11
IO7  (via drill 0.35)
  Top 0.152: v21.79,8.33 22.48,9.02 26.52,9.02 IC1.7
  Bottom 0.152: v21.79,8.33 20.88,7.42 20.88,7.04 20.42,6.58 19.58,6.58 J1.13
IO8  (via drill 0.35, 0.35 layers 15-16)
  Top 0.152: v24.84,14.73 25.53,14.73 26.21,15.42 26.52,15.42 IC1.12
  Route15 0.152: v24.84,14.73 24.84,13.21 22.4,10.77 22.4,10.08 21.77,9.45 v21.77,9.24
  Bottom 0.152: 21.79,9.25 20.57,8.03 20.57,7.26 20.34,7.04 19.58,7.04 J1.15
  Bottom 0.203: 21.79,9.25 v21.78,9.25 v21.77,9.24
IO9  (via drill 0.35)
  Top 0.152: v17.98,20.52 21.26,20.52 22.17,19.61 22.17,19.3 IC1.17
  Bottom 0.152: v17.98,20.52 14.17,20.52 5.49,11.84 5.49,11.23 8.91,7.8 18.44,7.8 18.67,7.57 19.51,7.57 J1.17
IO10  (via drill 0.35)
  Top 0.152: IC1.18 20.95,17.09 17.6,13.74 17.6,13.59 v15.47,11.46
  Bottom 0.152: v15.47,11.46 15.47,11.23 18.67,8.03 19.51,8.03 J1.19
IO11  (via drill 0.35)
  Top 0.152: v19.66,17.93 19.66,19.23 IC1.19
  Bottom 0.152: v19.66,17.93 16.08,14.35 16.08,11.15 18.67,8.56 19.51,8.56 J1.21
IO12  (via drill 0.35)
  Top 0.152: v18.03,15.44 18.03,19.21 IC1.20
  Bottom 0.152: v18.03,15.44 17.62,15.44 16.38,14.2 16.38,11.38 18.75,9.02 19.51,9.02 J1.23
IO13  (via drill 0.35)
  Top 0.152: IC1.21 17.14,14.05 v16.99,13.89
  Bottom 0.152: J1.25 19.51,9.55 18.67,9.55 16.69,11.53 16.69,13.6 v16.98,13.89 v16.99,13.89
IO14  (via drill 0.35, 0.35 layers 15-16)
  Top 0.152: v16.54,15.72 16.54,18.31 15.93,18.92 15.93,19.23 IC1.22
  Route15 0.152: v17.68,14.58 v16.54,15.72
  Bottom 0.152: J1.27 19.51,10.01 18.75,10.01 17.61,11.14 16.99,11.76 16.99,13.04 17.6,13.64 17.6,14.5 v17.68,14.58
IO15  (via drill 0.35)
  Top 0.152: v21.79,10.39 26.52,10.39 IC1.8
  Bottom 0.152: v21.79,10.39 19.66,10.39 19.58,10.46 J1.29
IO16  (via drill 0.35)
  Top 0.152: IC1.9 26.52,11.68 25.76,11.68 24.3,13.14 23.34,13.14 22.66,13.82 v21.51,13.82
  Bottom 0.152: J1.31 19.51,11.07 18.12,11.07 17.3,11.9 17.3,12.91 17.9,13.52 17.9,13.95 18.29,14.33 18.29,14.74 18.47,14.93 19.16,14.93 19.19,14.89 19.19,14.69 19.76,14.13 21.2,14.13 v21.51,13.82
IO17  (via drill 0.35, 0.35 layers 15-16)
  Top 0.152: v23.7,16.18 23.7,14.96 25.76,12.9 26.52,12.9 IC1.10
  Route15 0.152: v23.7,16.18 23.7,15.11 v22.78,14.2
  Bottom 0.152: J1.33 19.58,11.53 20.34,11.53 20.57,11.76 20.57,13.34 20.77,13.54 20.93,13.54 21.26,13.21 21.76,13.21 22.75,14.2 v22.78,14.2
IO18  (via drill 0.35)
  Top 0.152: IC1.11 26.59,14.2 26.82,14.2 27.58,14.96 27.58,18.47 27.36,18.69 25.68,18.69 25.45,18.47 25.45,18.39 23.85,16.79 23.45,16.79 23.09,16.43 23.09,15.28 22.26,14.45 21.07,14.45 20.27,13.65 20.27,12.2 19.94,11.87 18.24,11.87 v18.19,11.92
  Bottom 0.152: 19.52,11.99 J1.35 19.45,11.92 v18.19,11.92
N$1
  Top 0.152: R5.1 20.73,22.35 21.41,23.04 21.79,23.04 22.25,23.5 IC2.18
N$2  (via drill 0.35)
  Top 0.152: C2.2 5.25,32.33 R8.2 6.61,31.27 R2.2 6.63,31.4 v6,32.04 | IC3.8 11.23,28.5 11.47,28.26 v11.47,27.99
  Bottom 0.152: v11.47,27.99 9.58,29.88 9.58,31.27 9.24,31.6 8.65,31.6 8.57,31.52 8.04,31.52 7.53,32.04 v6,32.04
N$3
  Top 0.152: R7.1 23.24,22.35 | 23.24,22.35 R4.1 | 23.24,22.35 23.24,23.34 IC2.1
N$4
  Top 0.152: R3.2 21.34,23.65 21.64,23.65 21.95,23.95 22.25,23.95 IC2.17
N$5  (via drill 0.35 layers 1-2)
  Top 0.152: IC3.17 12.23,32.79 12.55,33.11 v13.39,33.11 | v7.22,1.47 6.81,1.89 R9.2
  Route2 0.152: v13.39,33.11 10.18,33.11 9.86,33.43 2.82,33.43 1.14,31.75 1.14,1.16 6.91,1.16 v7.22,1.47
N$6  (via drill 0.35 layers 1-2)
  Top 0.152: R10.2 6.03,8.96 v6.48,9.41 | IC3.18 11.72,32.94 11.67,33 10.5,33 10.2,32.71 v9.72,32.71
  Route2 0.152: v6.48,9.41 6.05,9.41 6.04,9.4 4.02,9.4 1.44,11.98 1.44,30.86 2.58,31.99 2.58,32.69 3.01,33.13 9.3,33.13 v9.72,32.71
N$7  (via drill 0.35)
  Top 0.152: 4.57,22.05 4.57,22.89 J8.6 | 4.57,22.05 4.57,21.97 | 2.06,22.05 J8.7 | 4.57,22.05 4.55,22.75 | 4.55,22.75 J8.6 | 4.88,28.83 4.57,29.13 J8.11 | J8.8 1.98,24.87 2,24.89 J8.9 | 1.98,27.23 J8.9 | 1.98,29.97 J8.10 | J8.9 1.98,27.3 2,27.33 J8.10 | J8.11 4.5,29.21 4.1,29.21 3.51,29.79 2.24,29.79 J8.10 | 2.06,29.97 J8.10 | J8.7 2.06,22.12 2.06,24.78 J8.8 | 2.06,24.79 J8.8 | J8.7 3.84,22.04 4.55,22.75 | J8.6 5.22,22.26 R6.1 | J8.6 5.06,22.42 C11.1 | 6.76,27.28 6.76,27.13 | D1.1 6.48,26.85 6.76,27.13 | J8.11 4.69,29.14 v5.91,30.35 | v7.32,28.07 7.32,27.69 6.76,27.13
  Bottom 0.152: v7.32,28.07 5.91,29.49 v5.91,30.35
N$8
  Top 0.152: R11.2 12.51,27.81 11.73,28.59 IC3.9
RXD0/SDA0  (via drill 0.35, 0.35 layers 1-2)
  Top 0.152: v10.36,6.58 9.07,6.58 IC1.36 8.99,6.5 6.55,6.5 5.94,5.89 I2C.1 6.03,5.93 R10.1 | v17.11,6.87 18.09,5.89 18.44,5.89 v19.36,6.81
  Route2 0.152: v19.36,6.81 22.45,6.81 24.51,8.86 24.51,11 v24.54,11 24.54,11.13 25.14,11.74 25.14,12.24 24.25,13.14 23.34,13.14 22.99,13.49 22.99,14.02 22.8,14.21 | 22.72,14.21 22.8,14.21 | 22.8,14.21 23.2,14.21
  Bottom 0.152: v24.54,11 24.08,10.54 23.16,10.54 J1.30 | v17.11,6.87 10.65,6.87 v10.36,6.58
SCLK  (via drill 0.35, 0.35 layers 1-2)
  Top 0.152: v15.77,7.87 10.36,7.87 | 10.36,7.87 9.07,7.87 IC1.35 | 10.36,7.87 v10.36,8.41 | JTAG.4 5.94,13.21 5.94,12.54 6.7,11.78 6.7,11.67 v7.68,10.7
  Route2 0.152: v15.77,7.87 17.4,9.5 17.4,10.79 17.91,11.3 v21.64,11.3
  Bottom 0.152: v21.64,11.3 21.86,11.07 23.09,11.07 J1.32 | v7.68,10.7 8.07,10.7 v10.36,8.41
TXD0/SCL0  (via drill 0.35)
  Top 0.152: IC1.37 8.99,5.21 7.09,5.21 6.48,4.6 5.94,4.6 I2C.2 | v5.79,10.01 4.65,8.87 4.65,5.36 5.41,4.6 5.87,4.6 I2C.2 | R9.1 6.07,4.44 I2C.2
  Route15 0.152: v5.79,10.01 5.79,11.23 v6.1,11.53
  Bottom 0.152: v6.1,11.53 13.41,18.85 20.12,18.85 23.55,15.42 23.55,15.11 25.15,13.51 25.15,10.69 24.46,10.01 23.16,10.01 J1.28
USB_D+  (via drill 0.35)
  Top 0.152: 5.26,26.01 4.72,26.01 J8.3 5.88,26.04 5.96,26.11 7.3,26.11 D1.2 9.32,28.13 v9.32,29.21 | IC3.4 8.9,30.49 v8.74,30.64
  Bottom 0.152: 9.27,29.25 9.27,30.11 v8.74,30.64
  Bottom 0.203: 9.27,29.25 v9.32,29.21
USB_D+/D8  (via drill 0.35)
  Top 0.152: v24.61,16.03 24.61,17.02 25.53,17.93 26.52,17.93 IC1.14
  Bottom 0.152: v24.61,16.03 24.61,15.87 25.45,15.04 25.45,9.02 24,7.57 23.16,7.57 J1.18
USB_D-
  Top 0.152: 4.72,26.62 J8.2 4.87,26.88 5.08,26.88 | D1.3 8.88,29.99 | D1.3 8.18,29.24 7.7,28.77 6.94,28.77 5.75,27.58 5.75,27.21 5.44,26.91 5.11,26.91 5.08,26.88 | D1.3 8.06,29.41 8.06,29.62 8.03,29.65 | 5.45,26.88 5.08,26.88
  Top 0.203: 8.88,29.99 IC3.5
USB_D-/D7  (via drill 0.35)
  Top 0.152: v25.22,16.71 26.52,16.71 IC1.13
  Bottom 0.152: v25.22,16.71 25.22,15.72 25.76,15.19 25.76,8.79 24,7.04 23.16,7.04 J1.16
VUSB  (via drill 0.35)
  Top 0.203: R2.1 7.64,30.65 D1.4 | J8.1 5.17,27.83 5.44,27.83 6.28,28.67 D1.4 | D1.4 7.14,29.29 v7.28,29.43 | v7.94,24.95 6.62,24.95 D2.2
  Bottom 0.203: v7.28,29.43 7.34,29.43 7.96,28.82 7.96,24.95 v7.94,24.95
(copper drawn outside any net)
  shapes: Top area x2